# Altium schematic sheet SC941C_STORRM2.SchDoc: Sorties TOR Relais Monostable 2/2
size 393 x 270 mm; CompanyName: Seccom; Address1: 521, rue du capt. François Garbit; Address2: 69440 Mornant; Address3: seccom@seccom.fr; Address4: www.seccom.fr; DocumentNumber: 6; SheetNumber: 6; SheetTotal: 9; PageSetup: Record=PageOptions|CenterHorizontal=True|CenterVertical=True|PrintScale=0.74|XCorrection=1.00|YCorrection=1.00|PrintKind=0|BorderSize=5000000|LeftOffset=0|BottomOffset=0|Orientation=2|PaperLength=1000|PaperWidth=1000|Scale=100|PaperSource=7|PrintQuality=-4|MediaType=1|DitherType=10|PaperKind=A4|PrintScaleMode=1
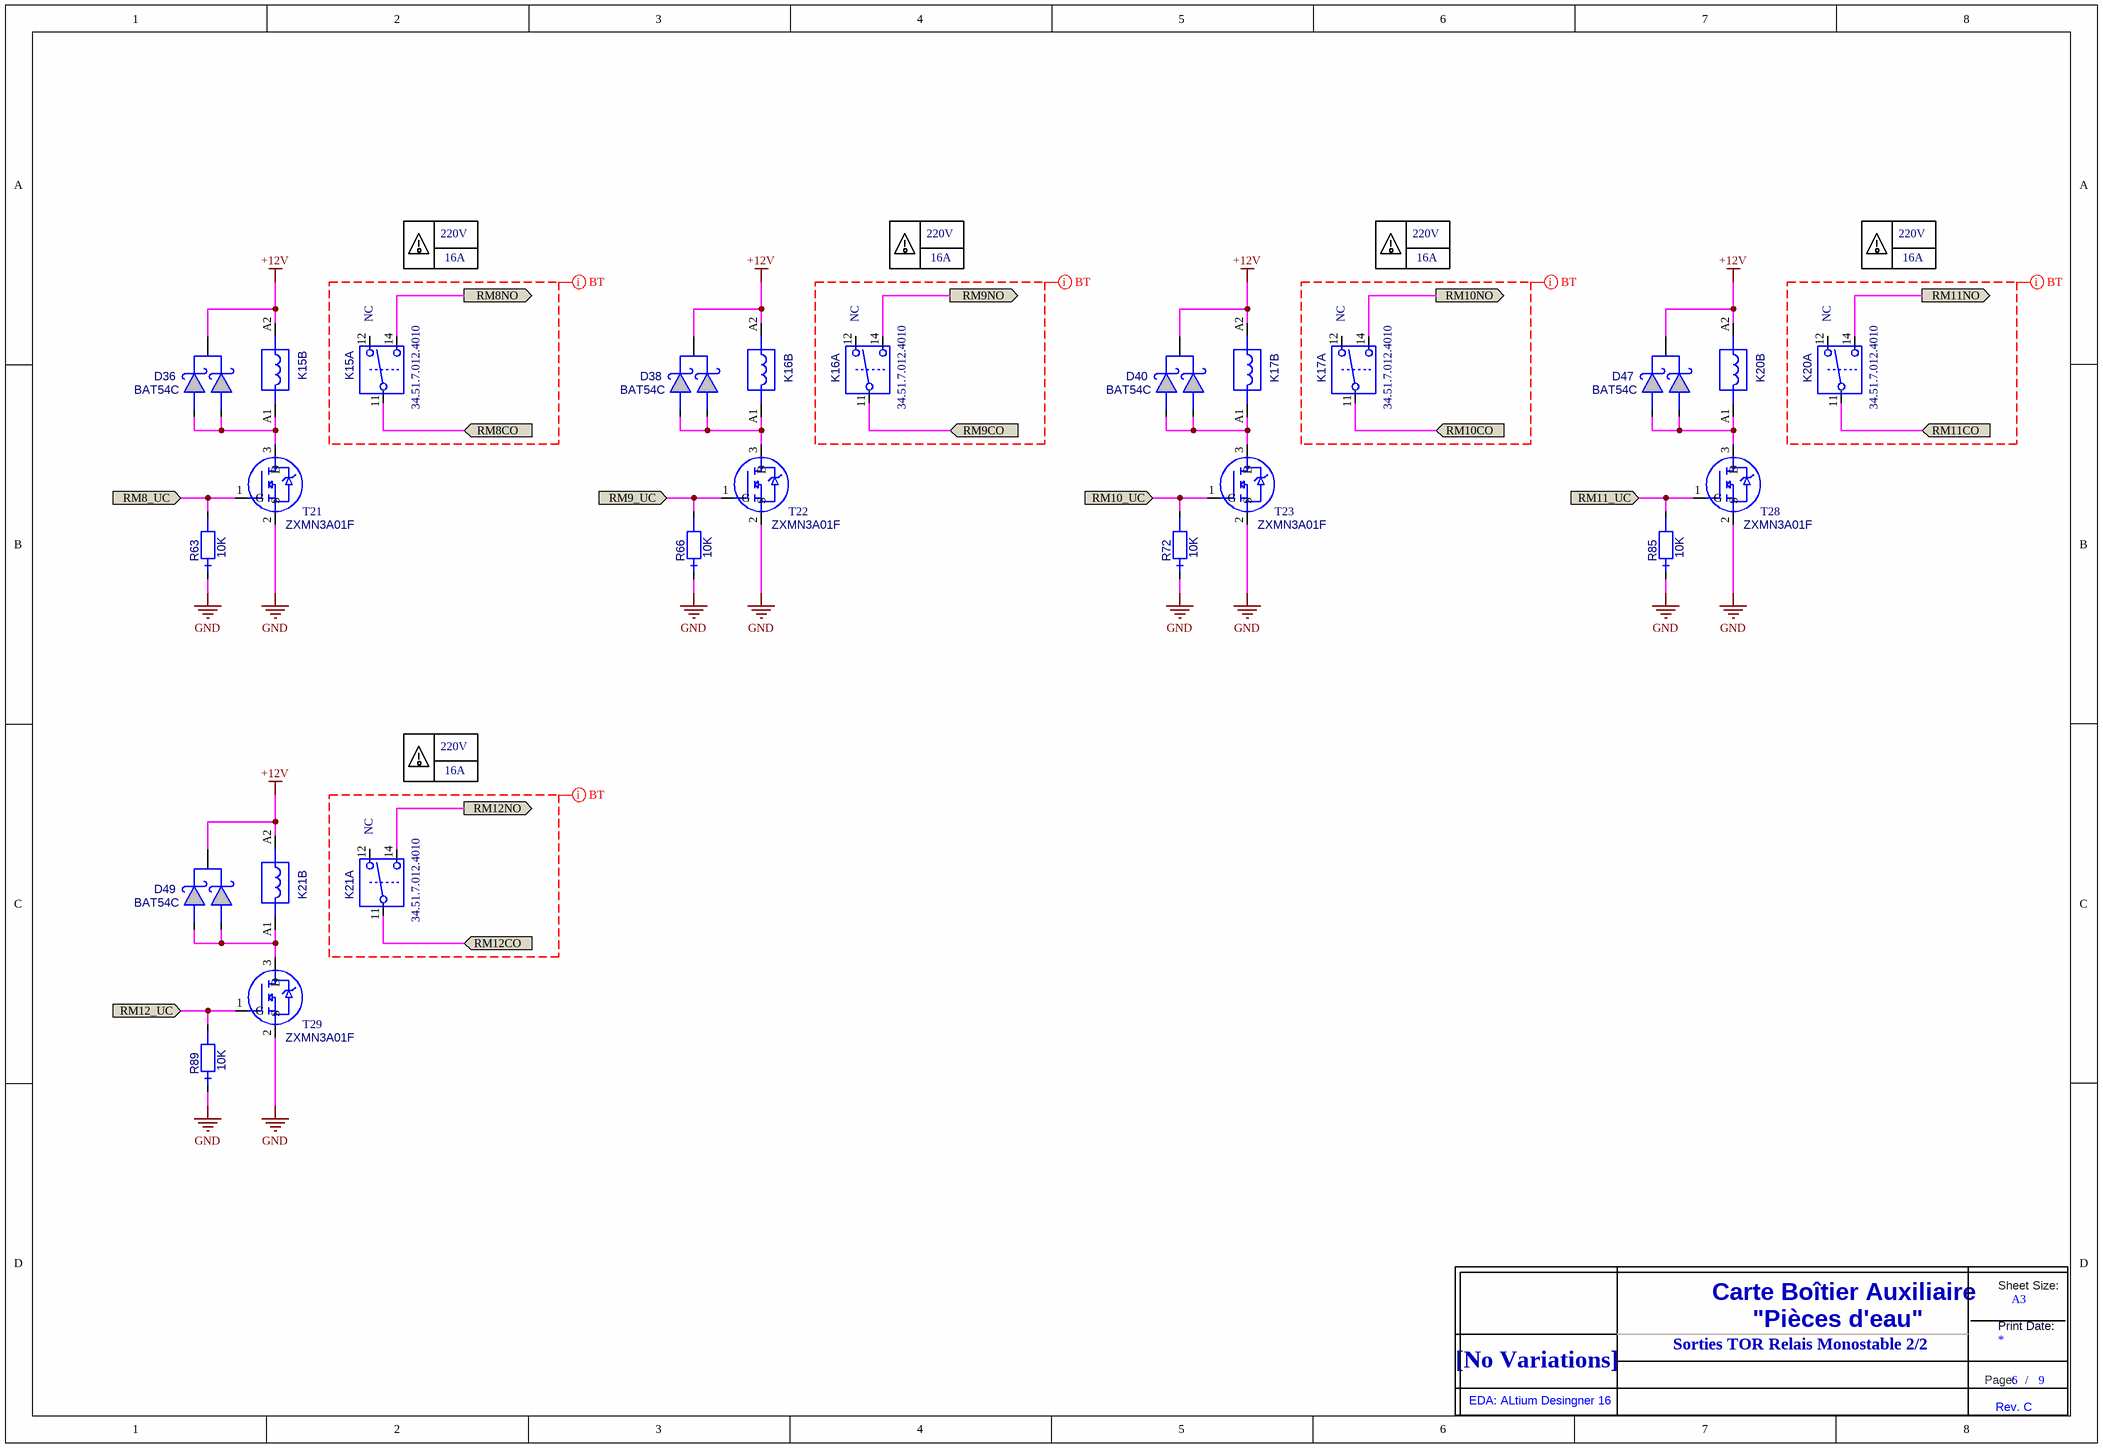
[diagram p0: SC941C_STORRM2.SchDoc]

## Parts
D36  BAT54C  [SOT23_3L_ReflowSoldering]
D38  BAT54C  [SOT23_3L_ReflowSoldering]
D40  BAT54C  [SOT23_3L_ReflowSoldering]
D47  BAT54C  [SOT23_3L_ReflowSoldering]
D49  BAT54C  [SOT23_3L_ReflowSoldering]
K15  RELAY_12VDC_1RT_34.51  [RELAY_FINDER_34.51_+SUPPORT_93]  (value not drawn)  (parts A,B of 2)
K16  RELAY_12VDC_1RT_34.51  [RELAY_FINDER_34.51_+SUPPORT_93]  (value not drawn)  (parts A,B of 2)
K17  RELAY_12VDC_1RT_34.51  [RELAY_FINDER_34.51_+SUPPORT_93]  (value not drawn)  (parts A,B of 2)
K20  RELAY_12VDC_1RT_34.51  [RELAY_FINDER_34.51_+SUPPORT_93]  (value not drawn)  (parts A,B of 2)
K21  RELAY_12VDC_1RT_34.51  [RELAY_FINDER_34.51_+SUPPORT_93]  (value not drawn)  (parts A,B of 2)
R63  value 10K  [0805_ReflowSoldering_RES]  (hidden comment: RES_0805_1%_100PPM_10K)
R66  value 10K  [0805_ReflowSoldering_RES]  (hidden comment: RES_0805_1%_100PPM_10K)
R72  value 10K  [0805_ReflowSoldering_RES]  (hidden comment: RES_0805_1%_100PPM_10K)
R85  value 10K  [0805_ReflowSoldering_RES]  (hidden comment: RES_0805_1%_100PPM_10K)
R89  value 10K  [0805_ReflowSoldering_RES]  (hidden comment: RES_0805_1%_100PPM_10K)
T21  ZXMN3A01F  [SOT23_3L_ReflowSoldering]
T22  ZXMN3A01F  [SOT23_3L_ReflowSoldering]
T23  ZXMN3A01F  [SOT23_3L_ReflowSoldering]
T28  ZXMN3A01F  [SOT23_3L_ReflowSoldering]
T29  ZXMN3A01F  [SOT23_3L_ReflowSoldering]
Title_new  DNI  (value not drawn)  (graphical)

## Ports
RM8_UC (in), RM8CO (in), RM8NO (out), RM9_UC (in), RM9CO (in), RM9NO (out), RM10_UC (in), RM10CO (in), RM10NO (out), RM11_UC (in), RM11CO (in), RM11NO (out), RM12_UC (in), RM12CO (in), RM12NO (out)

## Nets
+12V: D36.3 D38.3 D40.3 D47.3 D49.3 K15.A2 K16.A2 K17.A2 K20.A2 K21.A2
GND: R63.1 R66.1 R72.1 R85.1 R89.1 T21.2(S) T22.2(S) T23.2(S) T28.2(S) T29.2(S)
RM8_UC: R63.2 T21.1(G) ; port RM8_UC
RM8CO: K15.11(COM) ; port RM8CO
RM8NO: K15.14(NO) ; port RM8NO
RM9_UC: R66.2 T22.1(G) ; port RM9_UC
RM9CO: K16.11(COM) ; port RM9CO
RM9NO: K16.14(NO) ; port RM9NO
RM10_UC: R72.2 T23.1(G) ; port RM10_UC
RM10CO: K17.11(COM) ; port RM10CO
RM10NO: K17.14(NO) ; port RM10NO
RM11_UC: R85.2 T28.1(G) ; port RM11_UC
RM11CO: K20.11(COM) ; port RM11CO
RM11NO: K20.14(NO) ; port RM11NO
RM12_UC: R89.2 T29.1(G) ; port RM12_UC
RM12CO: K21.11(COM) ; port RM12CO
RM12NO: K21.14(NO) ; port RM12NO
NetD36_1: D36.1 D36.2 K15.A1 T21.3(D)
NetD38_1: D38.1 D38.2 K16.A1 T22.3(D)
NetD40_1: D40.1 D40.2 K17.A1 T23.3(D)
NetD47_1: D47.1 D47.2 K20.A1 T28.3(D)
NetD49_1: D49.1 D49.2 K21.A1 T29.3(D)

Not connected (* = marked no-connect by the designer): K15 12(NC); K16 12(NC); K17 12(NC); K20 12(NC); K21 12(NC)

## Layout directives
net class BT: (no net found under the mark)

## Notes on the sheet
- 220V
- (near K15) NC
- 16A
- (near K16) NC
- (near K17) NC
- (near K20) NC
- (near K21) NC
- Sorties TOR Relais Monostable 2/2
- (in symbol Title_new) Sheet Size:; Carte Boîtier Auxiliaire; A3; "Pièces d'eau"; Print Date:; [No Variations]; Page:; /; EDA: ALtium Desingner 16; Rev. C

## Library data of the parts
D36 D38 D40 D47 D49 = BAT54C: Diode Schottky double, BAT54 cathode com, Vrrm=30V, If=300mA, Vf=0.4Vmax, CMS; Creation: LJ (14/05/02); Reference: 000597/00; Boitier: SOT23_3L; Remarque: {Remarque}; Fabricant: NXP; Coeff: 1; Verification: LJ (14/05/02); Ref Fab: BAT54C; ComponentLink1URL: o:\_Documentation\Datasheets\NXP\BAT54_series.pdf; ComponentLink2URL: o:\_Documentation\Datasheets\_BOITIERS\ACTIF_CMS\SOT\SOT_23_3P_(Schneider).PDF; Config: *; ComponentLink1Description: Datasheet; ComponentLink2Description: Datasheet Boitier; Value: BAT54C; Supplier 1: Farnell; Supplier Part Number 1: 1081192
K15-K17 K20 K21 = RELAY_12VDC_1RT_34.51: Relais 1RT, 12Vdc, série 34.51, Rc=1940R, Sw:250Vac/6A, Ron=? (AgSnO2); Creation: CHD; Verification: LJ (24/11/11); Boitier: DIP12 Form C; Remarque: {Remarque}; Fabricant: Finder; Ref Fab: 34.51.7.012.4010; Coeff: 1; Value: 34.51.7.012.4010; ComponentLink1URL: o:\_Documentation\Datasheets\Finder\Relais_Serie_34.pdf; ComponentLink2URL: o:\_Documentation\Datasheets\_BOITIERS\; Config: *; ComponentLink1Description: Datasheet; ComponentLink2Description: Datasheet Boitier
R63 R66 R72 R85 R89 = RES_0805_1%_100PPM_10K: Résistance CMS 0805, 0.125W, 1%, 100ppm, 150V; Creation: LJ (06/02/09); Reference: 000063/00; Boitier: 0805; Remarque: {Remarque}; Fabricant: Yageo; Ref Fab: RC0805FR-0710KL; Coeff: 1; Verification: *; ComponentLink1URL: o:\_Documentation\Datasheets\BC_Components\Resistances_ThickFilmFlatChip_0402-0603-0805-1206.pdf; ComponentLink2URL: o:\_Documentation\Datasheets\_BOITIERS\PASSIF_CMS\RC_0805_(2x1,25)_(Schneider).PDF; Config: *; ComponentLink1Description: Datasheet; ComponentLink2Description: Datasheet Boitier; Supplier 1: Farnell; Supplier Part Number 1: 9237755
T21-T23 T28 T29 = ZXMN3A01F: Transistor MOSN logique, Vdss=30V, Id=2A, Rdson=0.12R, CMS; Boitier: SOT23_3L; Remarque: {Remarque}; Creation: CHD; Fabricant: Zetex; Coeff: 1; Ref Fab: ZXMN3A01F; ComponentLink1URL: o:\_Documentation\Datasheets\; ComponentLink2URL: o:\_Documentation\Datasheets\_BOITIERS\ACTIF_CMS\SOT\SOT_23_3P_(Schneider).PDF; Config: *; ComponentLink1Description: Datasheet; Value: ZXMN3A01F; Supplier 1: Farnell; Supplier 2: Mouser; Supplier Part Number 1: 9525734; Supplier Part Number 2: 522-ZXMN3A01FTA
Title_new = Title_new